# Altium schematic sheet usb-sys.SchDoc
size A4; SheetNumber: 4; SheetTotal: 8
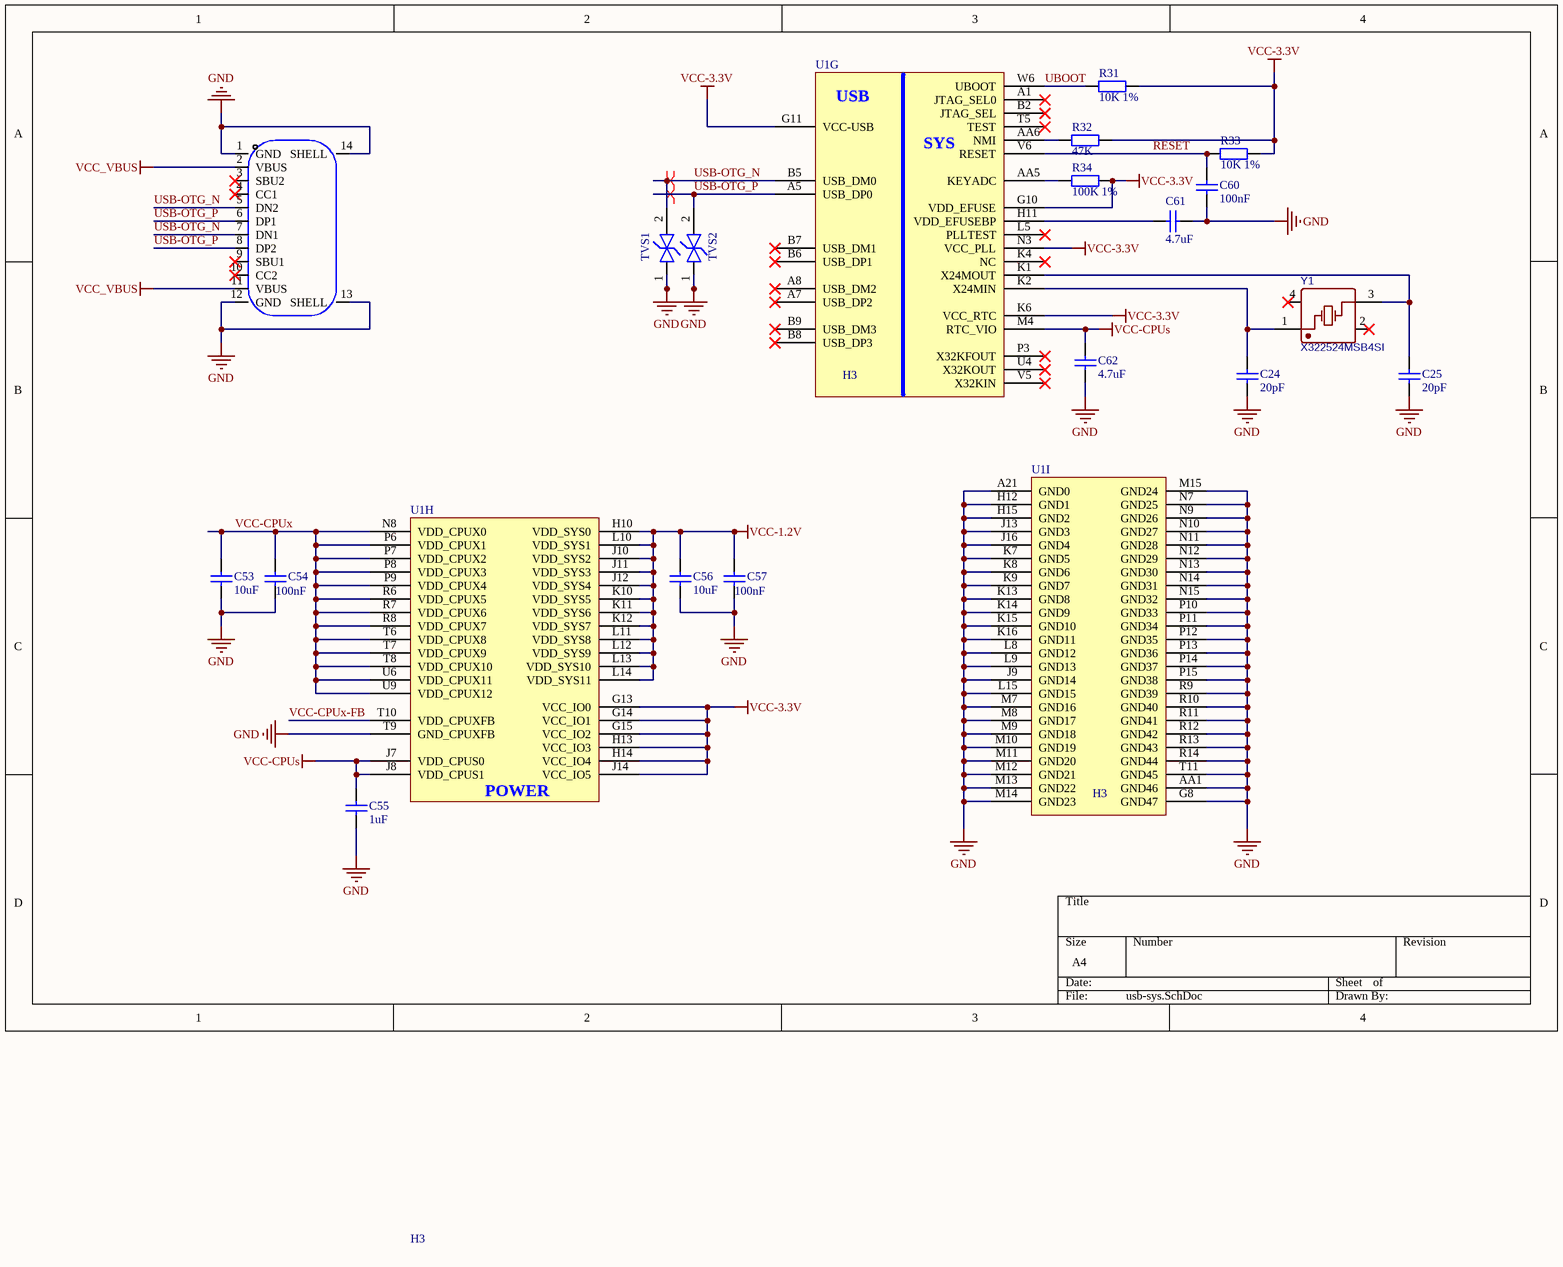
[diagram p0: usb-sys.SchDoc]

## Parts
C24  20pF  [0402_C]
C25  20pF  [0402_C]
C53  10uF  [0402_C]
C54  100nF  [0402_C]
C55  1uF  [0402_C]
C56  10uF  [0402_C]
C57  100nF  [0402_C]
C60  100nF  [0402_C]
C61  4.7uF  [0402_C]
C62  4.7uF  [0402_C]
R31  10K 1%  [0402_R]
R32  47K  [0402_R]
R33  10K 1%  [0402_R]
R34  100K 1%  [0402_R]
TVS1  BSD5C051L  [SOD-523_TVS]  (value not drawn)
TVS2  BSD5C051L  [SOD-523_TVS]  (value not drawn)
typec-1  TYPE-C 16PIN 2MD(073)  [TYPE-C 16PIN 2MD(073)]  (value not drawn)
U1  H3  [allwinner-h3]  (parts G,H,I of 9)
Y1  X322524MSB4SI  [SMD3225-4P]

## Nets
GND: C24.2 C25.2 C53.2 C54.2 C55.2 C56.2 C57.2 C60.1 C61.2 C62.2 TVS1.1 TVS2.1 typec-1.1(GND) typec-1.12(GND) typec-1.13(SHELL) typec-1.14(SHELL) U1.A21(GND0) U1.AA1(GND46) U1.G8(GND47) U1.H12(GND1) U1.H15(GND2) U1.J9(GND14) U1.J13(GND3) U1.J16(GND4) U1.K7(GND5) U1.K8(GND6) U1.K9(GND7) U1.K13(GND8) U1.K14(GND9) U1.K15(GND10) U1.K16(GND11) U1.L8(GND12) U1.L9(GND13) U1.L15(GND15) U1.M7(GND16) U1.M8(GND17) U1.M9(GND18) U1.M10(GND19) U1.M11(GND20) U1.M12(GND21) U1.M13(GND22) U1.M14(GND23) U1.M15(GND24) U1.N7(GND25) U1.N9(GND26) U1.N10(GND27) U1.N11(GND28) U1.N12(GND29) U1.N13(GND30) U1.N14(GND31) U1.N15(GND32) U1.P10(GND33) U1.P11(GND34) U1.P12(GND35) U1.P13(GND36) U1.P14(GND37) U1.P15(GND38) U1.R9(GND39) U1.R10(GND40) U1.R11(GND41) U1.R12(GND42) U1.R13(GND43) U1.R14(GND44) U1.T9(GND_CPUXFB) U1.T11(GND45)
VCC-1.2V: C56.1 C57.1 U1.H10(VDD_SYS0) U1.J10(VDD_SYS2) U1.J11(VDD_SYS3) U1.J12(VDD_SYS4) U1.K10(VDD_SYS5) U1.K11(VDD_SYS6) U1.K12(VDD_SYS7) U1.L10(VDD_SYS1) U1.L11(VDD_SYS8) U1.L12(VDD_SYS9) U1.L13(VDD_SYS10) U1.L14(VDD_SYS11)
VCC-3.3V: R31.2 R32.2 R33.2 R34.2 U1.G10(VDD_EFUSE) U1.G11(VCC-USB) U1.G13(VCC_IO0) U1.G14(VCC_IO1) U1.G15(VCC_IO2) U1.H13(VCC_IO3) U1.H14(VCC_IO4) U1.J14(VCC_IO5) U1.K6(VCC_RTC) U1.N3(VCC_PLL)
VCC-CPUs: C55.1 C62.1 U1.J7(VDD_CPUS0) U1.J8(VDD_CPUS1) U1.M4(RTC_VIO)
VCC_VBUS: typec-1.2(VBUS) typec-1.11(VBUS)
RESET: C60.2 R33.1 U1.V6(RESET)
UBOOT: R31.1 U1.W6(UBOOT)
USB-OTG_N: TVS1.2 typec-1.5(DN2) typec-1.7(DN1) U1.B5(USB_DM0)
USB-OTG_P: TVS2.2 typec-1.6(DP1) typec-1.8(DP2) U1.A5(USB_DP0)
VCC-CPUx: C53.1 C54.1 U1.N8(VDD_CPUX0) U1.P6(VDD_CPUX1) U1.P7(VDD_CPUX2) U1.P8(VDD_CPUX3) U1.P9(VDD_CPUX4) U1.R6(VDD_CPUX5) U1.R7(VDD_CPUX6) U1.R8(VDD_CPUX7) U1.T6(VDD_CPUX8) U1.T7(VDD_CPUX9) U1.T8(VDD_CPUX10) U1.U6(VDD_CPUX11) U1.U9(VDD_CPUX12)
VCC-CPUx-FB: U1.T10(VDD_CPUXFB)
NetC24_1: C24.1 U1.K2(X24MIN) Y1.1(OE#)
NetC25_1: C25.1 U1.K1(X24MOUT) Y1.3(OUT)
NetC61_1: C61.1 U1.H11(VDD_EFUSEBP)
NetR32_1: R32.1 U1.AA6(NMI)
NetR34_1: R34.1 U1.AA5(KEYADC)

Not connected (* = marked no-connect by the designer): typec-1 3(SBU2)* 4(CC1)* 9(SBU1)* 10(CC2)*; U1 A1(JTAG_SEL0)* A7(USB_DP2)* A8(USB_DM2)* B2(JTAG_SEL)* B6(USB_DP1)* B7(USB_DM1)* B8(USB_DP3)* B9(USB_DM3)* K4(NC)* L5(PLLTEST)* P3(X32KFOUT)* T5(TEST)* U4(X32KOUT)* V5(X32KIN)*; Y1 2(GND)* 4(VDD)*

## Layout directives
differential pair: USB-OTG_N, USB-OTG_P

## Notes on the sheet
- (in symbol H3_CPU, part G) USB; SYS
- (in symbol H3_CPU, part H) POWER

## Library data of the parts
C24 C25 C53-C57 C60-C62 = CAP-SMD: smd capacitor
R31-R34 = RES-SMD: smd resistor
TVS1 TVS2 = TVS-DIODE-SMD: Transient Voltage Suppressor
typec-1 = TYPE-C-16PIN: type-c
U1 = H3_CPU: CPU
Y1 = XO-N-SOURCE-4pin: 24mHZ ,20pf , no source smd crystal oscillator